# EAGLE design super-serial (EAGLE 7.3.0)
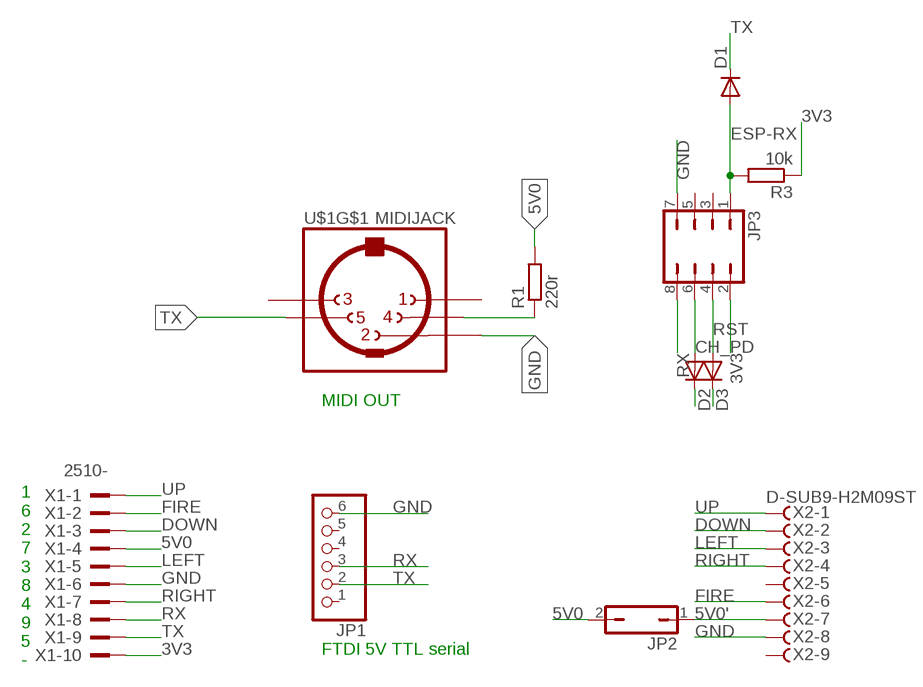
[diagram p0: schematic, sheet 1]

## Parts
D1  DIODEDO-1N4148  [DO-1N4148]
D2  DIODEDO-1N4148  [DO-1N4148]
D3  DIODEDO-1N4148  [DO-1N4148]
JP1  PINHD-1X6CB  [1X06-CLEANBIG]
JP2  JP1Q  [JP1]
JP3  JP4Q  [JP4Q]
R1  220r  R-EU_0204/7  [0204/7]
R3  10k  R-EU_0204/7  [0204/7]
U$1  MIDIJACK  [CP-2350]
X1  2510-  [PAK100/2500-10]
X2  D-SUB9-H2M09ST  [H2M09ST]

## Nets
3V3: JP3.2 R3.1 X1.10
5V0: JP2.2 R1.2 X1.4
5V0': JP2.1 X2.7
CH_PD: D2.A JP3.6
DOWN: X1.3 X2.2
ESP-RX: D1.A JP3.1 R3.2
FIRE: D3.C X1.2 X2.6
GND: JP1.6 JP3.7 U$1.2 X1.6 X2.8
LEFT: X1.5 X2.3
N$5: R1.1 U$1.4
RIGHT: X1.7 X2.4
RST: D3.A JP3.4
RX: JP1.3 JP3.8 X1.8
TX: D1.C JP1.2 U$1.5 X1.9
UP: D2.C X1.1 X2.1
Unconnected: JP1.1 JP1.4 JP1.5 JP3.3 JP3.5 U$1.1 U$1.3 U$1.PE1(MT) U$1.PE2(MT) U$1.PE(MT) U$1.PE@(MT) X2.5 X2.9

## Notes on the sheet
- MIDI OUT
- FTDI 5V TTL serial
- 1
  6
  2
  7
  3
  8
  4
  9
  5
  -

## Library data of the parts
D1-D3 = adafruit:DIODE: Diode SMADIODE - SMA Surface Mount Package 20V 1A Schottky Diode Digikey: 641-1014-6-ND DO-1N4148 - Through Hole Small Current Diode SOD-123 20V 1 A (.5mV Vf) Schottky Diode - Digikey: MBRX120TPMSCT-ND SOD-323 10V 570mA (.38mV Vf, 3ns) Schottky Diode - Digikey: ZLLS410CT-ND SOD-523 30V 30mA Schottky Diode (RB751S-40TE61) - Digikey: RB751S-40TE61CT-ND SOT23-R/W - SOT23 Package (R = Solder Paste/Reflow Ovens, W = Hand-Soldering) BAT54Film 40V 300mA - Digikey: 497-7162-1-ND
JP1 = adafruit:PINHD-1X6: PIN HEADER
JP2 = jumper:JP1Q: JUMPER
JP3 = jumper:JP4Q: JUMPER
R1 R3 = rcl:R-EU_: RESISTOR, European symbol
U$1 = adafruit:MIDIJACK: DIN 5 jack also known as MIDI jack A modification of conn-hirshman:MAB5SH with two options for the grounding 'teeth'
X1 = con-3m:2510-: 3M (TM) Pak 100 4-Wall Header Source: 3M; MF: 3M; MPN: 2510-6002UB; OC_FARNELL: 9838244; OC_NEWARK: 46F4725
X2 = con-thomas-betts:D-SUB9-: D-Subminiatur Connector Source: Electronioc Interconnects European Edition 1998; OC_FARNELL: unknown; OC_NEWARK: unknown

## Board
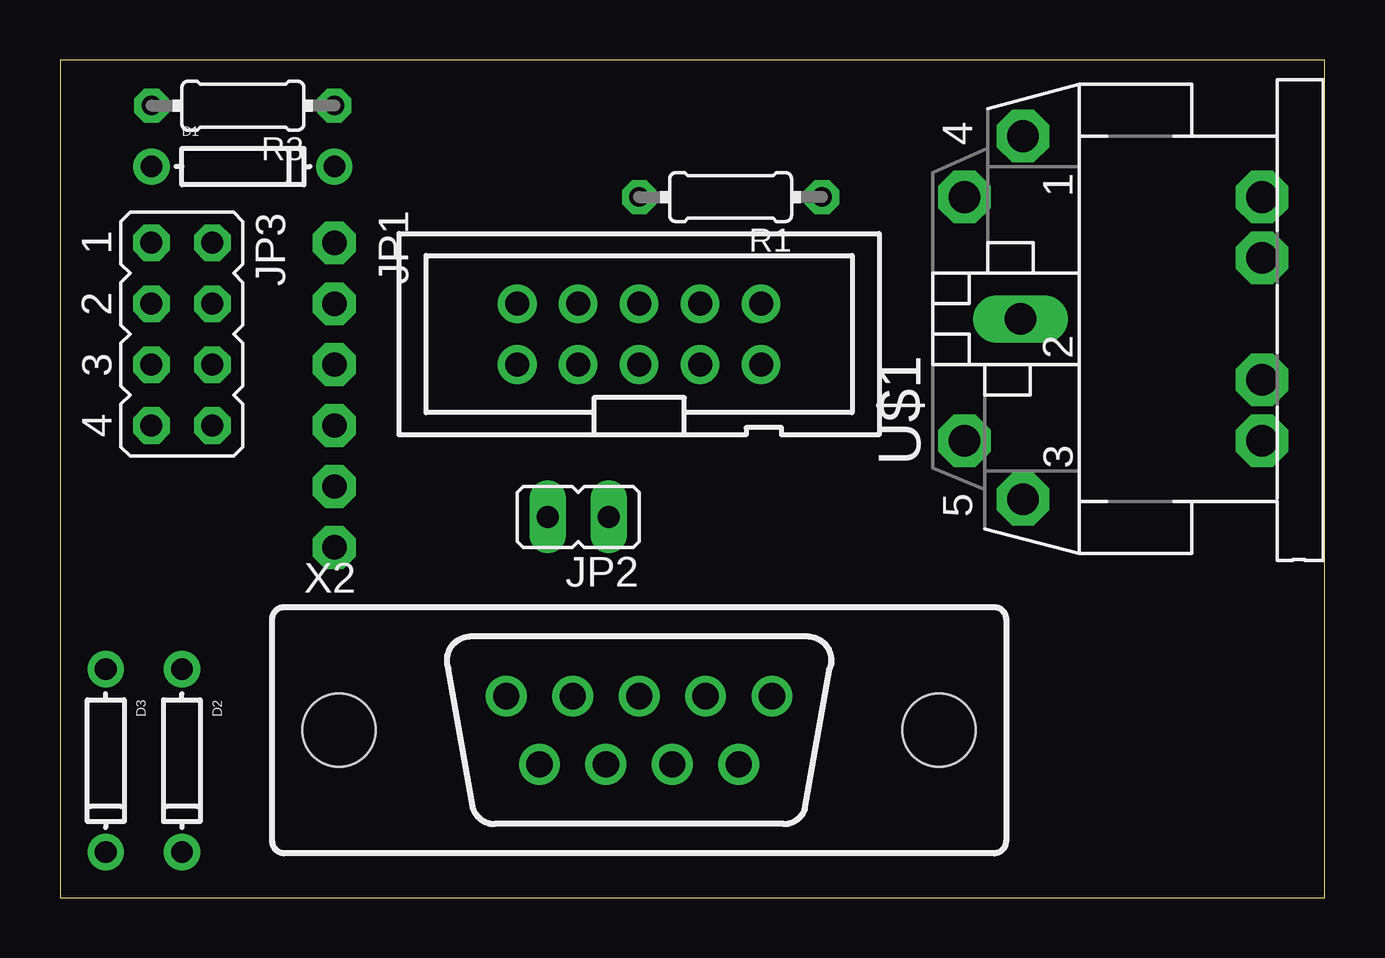
[diagram p1: board, top side]
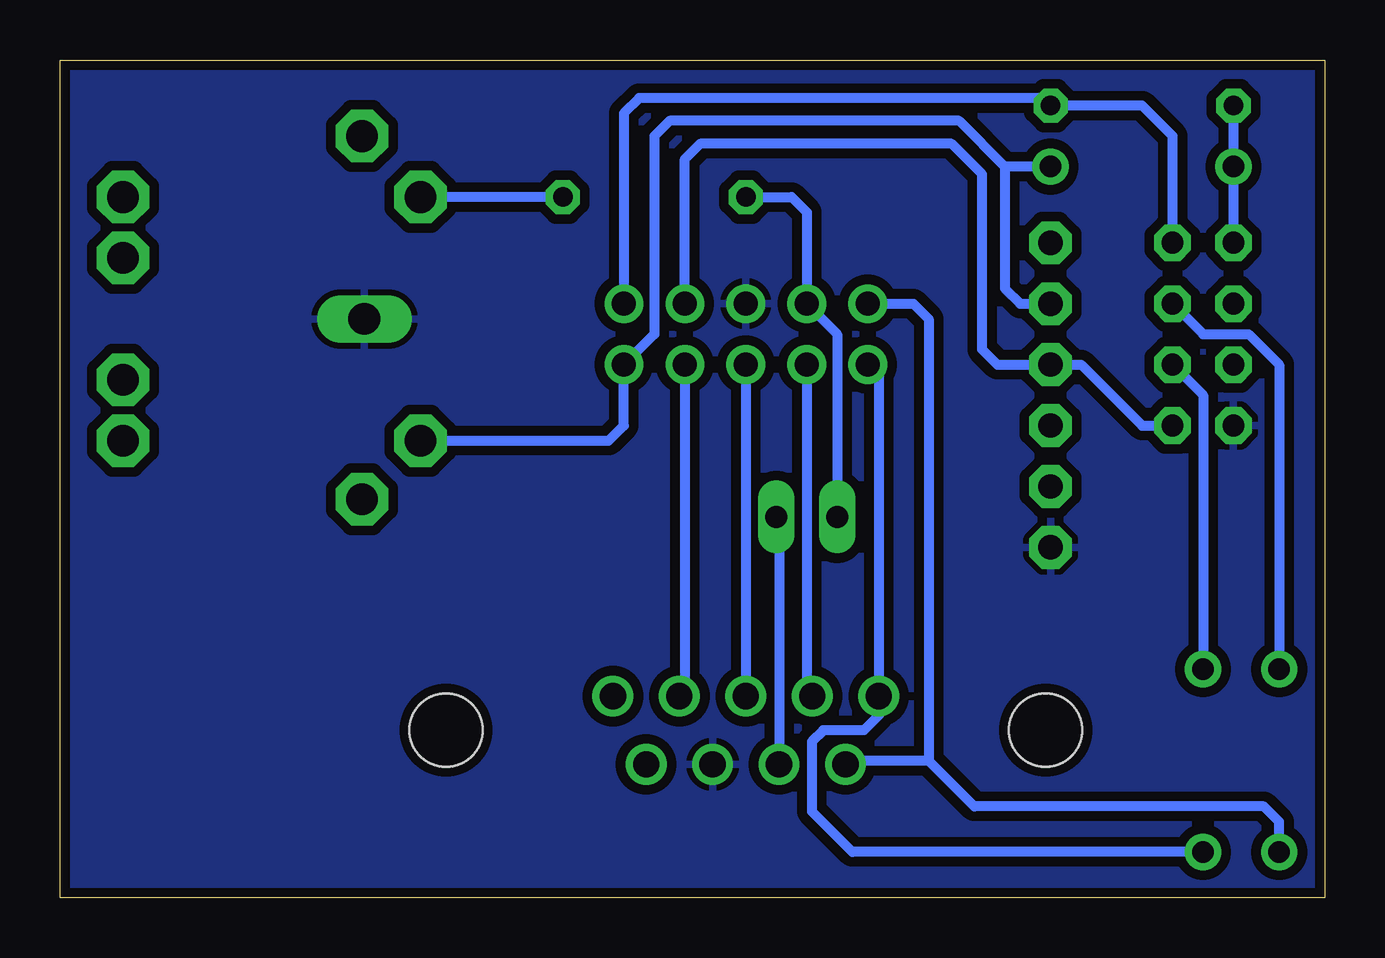
[diagram p2: board, bottom side, seen from below]

Size 52.7 x 34.92 mm. Coordinates in mm from the lower left corner, seen from the top.
Outline: 0,0 52.7,0 52.7,34.92 0,34.92 0,0
Copper layers (1*16): Top 0.035mm / dielectric 1.5mm / Bottom 0.035mm
Design rules "SparkFun": minimum track width 8mil, minimum drill 20mil, track to track 8mil, track to pad 8mil, pad to pad 8mil, via to via 8mil, smd to smd 8mil, copper to edge 10mil, drill to drill 8mil, minimum pad ring 12mil, minimum via ring 10mil, stop-mask expansion 4mil, vias tented up to drill 25mil, thermal gap 10mil

### Footprints (pad centres in the part's own frame; a part is rotated, then mirrored left to right if it is on the bottom)
DO-1N4148 = drill 0.9: A -3.81,0; C 3.81,0
1X06-CLEANBIG = drill 1.016 pad 1.778 octagon: 1 -6.35,0; 2 -3.81,0; 3 -1.27,0; 4 1.27,0; 5 3.81,0; 6 6.35,0
JP1 = drill 0.914 long: 1 0,-1.27; 2 0,1.27
JP4Q = drill 0.914 octagon: 1 -3.81,-1.27; 2 -3.81,1.27; 3 -1.27,-1.27; 4 -1.27,1.27; 5 1.27,-1.27; 6 1.27,1.27; 7 3.81,-1.27; 8 3.81,1.27
0204/7 = drill 0.813 octagon: 1 -3.81,0; 2 3.81,0
CP-2350 = drill 1.321 pad 2.184 octagon: 1 7.62,12.58; 3 -7.52,12.58; 4 5.08,15.02; 5 -5.08,15.02; PE -2.54,2.62; PE1 -5.08,2.62; PE2 5.08,2.62; PE@ 2.54,2.62 | drill 1.321 long: 2 0,12.68
PAK100/2500-10 = drill 1 pad 1.422: 1 -5.08,-1.27; 2 -5.08,1.27; 3 -2.54,-1.27; 4 -2.54,1.27; 5 0,-1.27; 6 0,1.27; 7 2.54,-1.27; 8 2.54,1.27; 9 5.08,-1.27; 10 5.08,1.27
H2M09ST = drill 1.092: 1 -5.537,1.422; 2 -2.769,1.422; 3 0,1.422; 4 2.769,1.422; 5 5.537,1.422; 6 -4.153,-1.422; 7 -1.384,-1.422; 8 1.384,-1.422; 9 4.153,-1.422 | hole 3.048: -12.497,0; 12.497,0

### Placement (x,y rotation side)
D1  7.62,30.48 0 top
D2  5.08,5.71 270 top
D3  1.91,5.71 270 top
JP1  11.43,20.95 270 top
JP2  21.59,15.88 90 top
JP3  5.08,23.49 270 top
R1  27.94,29.21 180 top
R3  7.62,33.02 180 top
U$1  52.7,24.13 90 top
X1  24.13,23.49 0 top
X2  24.13,6.98 0 top

### Tracks (layer width: path | path; a pad name or v marks a point on that pad's centre or on a via)
3V3
  Bottom 0.406: X1.10 29.21,32.7 28.58,33.34 11.75,33.34 R3.1 7.62,33.02 6.35,31.75 JP3.2
5V0
  Bottom 0.406: R1.2 22.23,29.21 21.59,28.58 X1.4 20.32,23.49 JP2.2
5V0'
  Bottom 0.406: JP2.1 22.75,15.76 X2.7
CH_PD
  Bottom 0.406: JP3.6 5.08,20.95 D2.A
DOWN
  Bottom 0.406: X1.3 21.59,8.64 X2.2
ESP-RX
  Bottom 0.406: R3.2 D1.A JP3.1
FIRE
  Bottom 0.406: X1.2 17.14,24.77 16.51,24.13 16.51,5.71 | 16.51,5.71 19.82,5.71 X2.6 | D3.C 1.91,3.18 2.54,3.81 14.61,3.81 16.51,5.71
GND
  pour Bottom (isolate 0.406): 0,34.92 52.7,34.92 52.7,0 0,0
LEFT
  Bottom 0.406: X1.5 X2.3
N$5
  Bottom 0.406: R1.1 U$1.4
RIGHT
  Bottom 0.406: X1.7 26.67,8.64 X2.4
RST
  Bottom 0.406: JP3.4 5.08,23.49 3.18,23.49 1.91,22.23 D3.A
RX
  Bottom 0.406: X1.8 26.67,30.8 26.04,31.43 15.56,31.43 14.29,30.16 14.29,22.86 13.65,22.23 JP1.3 10.16,22.23 7.62,19.68 JP3.8
TX
  Bottom 0.406: U$1.5 29.84,19.05 29.21,19.68 X1.9 27.94,23.49 27.94,31.75 27.3,32.38 15.24,32.38 13.34,30.48 | D1.C 13.34,30.48 | 13.34,30.48 13.34,25.4 12.7,24.77 JP1.2
UP
  Bottom 0.406: X1.1 18.59,21.77 X2.1 18.41,8.25 18.57,7.62 19.21,6.98 20.91,6.98 21.38,6.51 21.38,3.6 19.69,1.91 D2.C